# Altium schematic sheet Power.SchDoc
size A; SheetNumber: 1; SheetTotal: 2
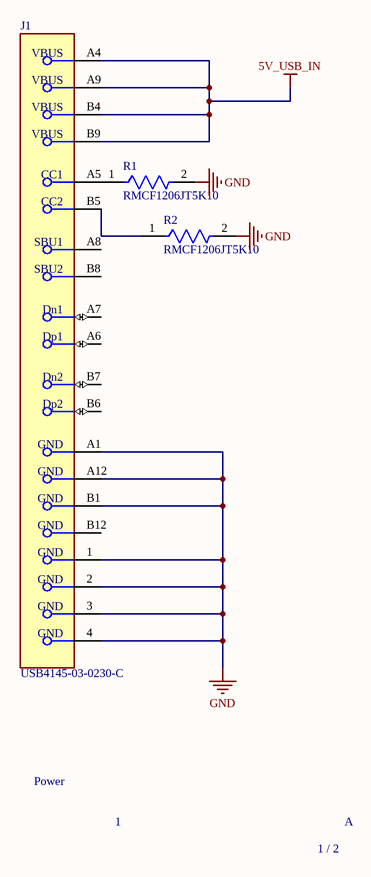
[diagram p0: Power.SchDoc]

## Parts
J1  USB4145-03-0230-C  [FP-USB4145-03-0230-C-MFG]
R1  RMCF1206JT5K10  [FP-RMCF1206-IPC_C]
R2  RMCF1206JT5K10  [FP-RMCF1206-IPC_C]

## Nets
5V_USB_IN: J1.A4(VBUS) J1.A9(VBUS) J1.B4(VBUS) J1.B9(VBUS)
GND: J1.1(GND) J1.2(GND) J1.3(GND) J1.4(GND) J1.A1(GND) J1.A12(GND) J1.B1(GND) R1.2 R2.2
NetJ1_A5: J1.A5(CC1) R1.1
NetJ1_B5: J1.B5(CC2) R2.1

Not connected (* = marked no-connect by the designer): J1 A6(Dp1) A7(Dn1) A8(SBU1) B6(Dp2) B7(Dn2) B8(SBU2) B12(GND)

## Notes on the sheet
- Power
- 1
- 1 / 2
- A

## Library data of the parts
J1 = CMP-03329-129995627-1: USB4145-03-0230-C USB Connectors USB-C Rec 3u Vert 16P SMT 2.3mm TH stakes H7.46mm T+R+Cap; Number of Contacts: 16; USB Standard: USB 2.0; Voltage Rating: 48V; Current Rating: 6.25A; Min Operating Temperature: -25°C; Contact Material: Gold, Nickel; Height: 7.66mm; NexarPartId: 129995627; Max Operating Temperature: 85°C
R1 R2 = CMP-26527-004028-1: 5.1kΩ ±5% 0.25W 1206 Thick Film Chip Resistor AEC-Q200 compliant; Temperature Coefficient: 200ppm/°C; Power Rating: 250mW; Resistance: 5.1kR; Lead Free: Lead Free; Max Operating Temperature: 155°C; Length: 0.126inch; Construction: Rectangular; Case Code (Imperial): 1206; RoHS Compliant: Yes; Max Power Dissipation: 250mW; Size Code: 1206; Mount: Surface Mount; Case Code (Metric): 3216; Tolerance: 5%; Features: Automotive AEC-Q200; Min Operating Temperature: -55°C; Radiation Hardening: No; Resistor Type: Thick Film; Depth: 1.6mm; Packaging: Tape and Reel; Contact Plating: Tin; Number of Terminations: 2; Height: 0.028inch; Military Standard: Not; Case/Package: 1206; Width: 0.063inch; Series: RMCF